# Altium schematic sheet FPGA Power.SchDoc
size A2; SheetNumber: 6; SheetTotal: 12
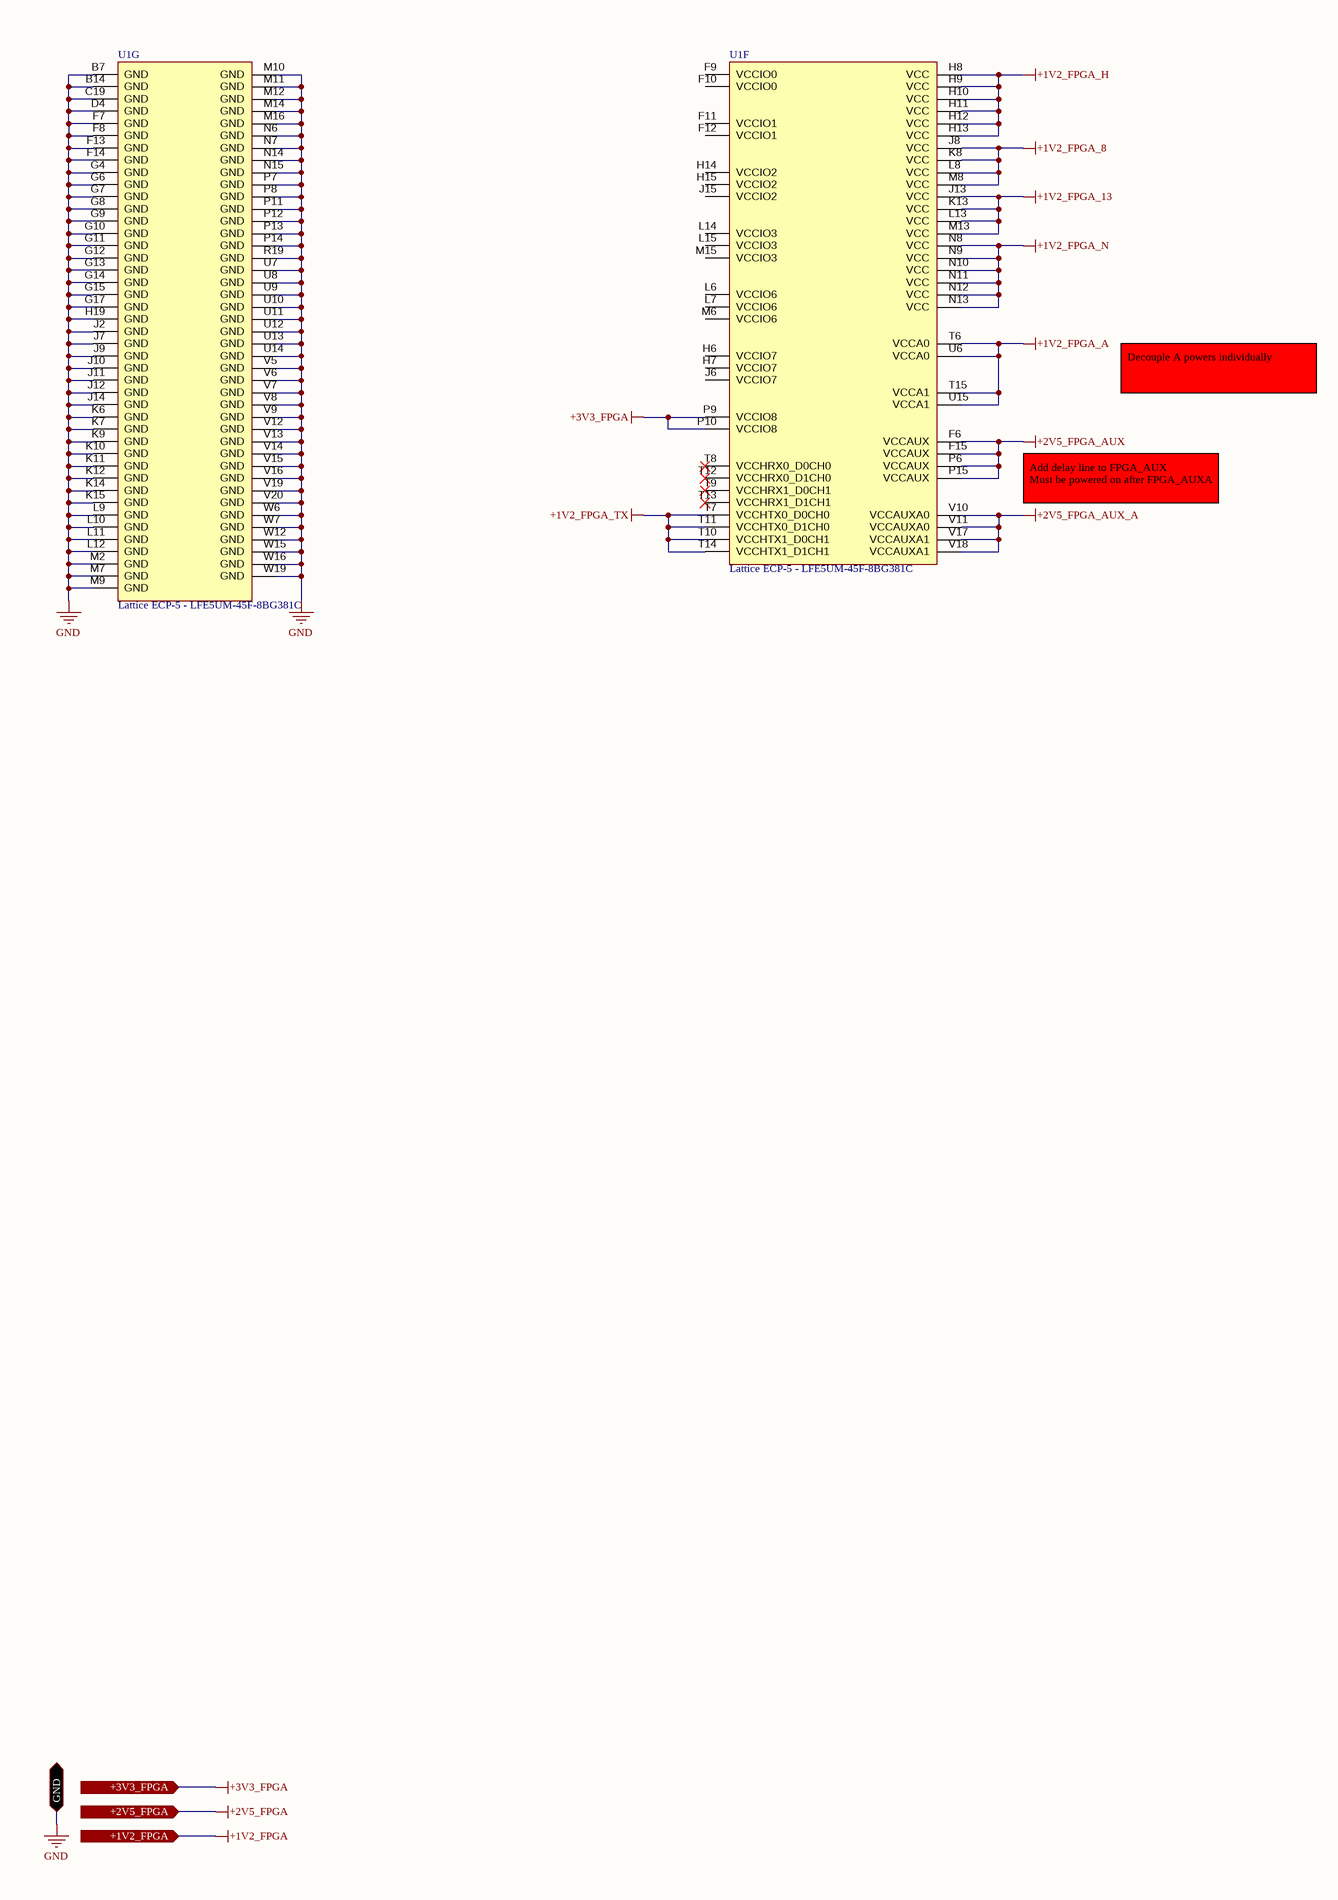
[diagram p0: FPGA Power.SchDoc, left]
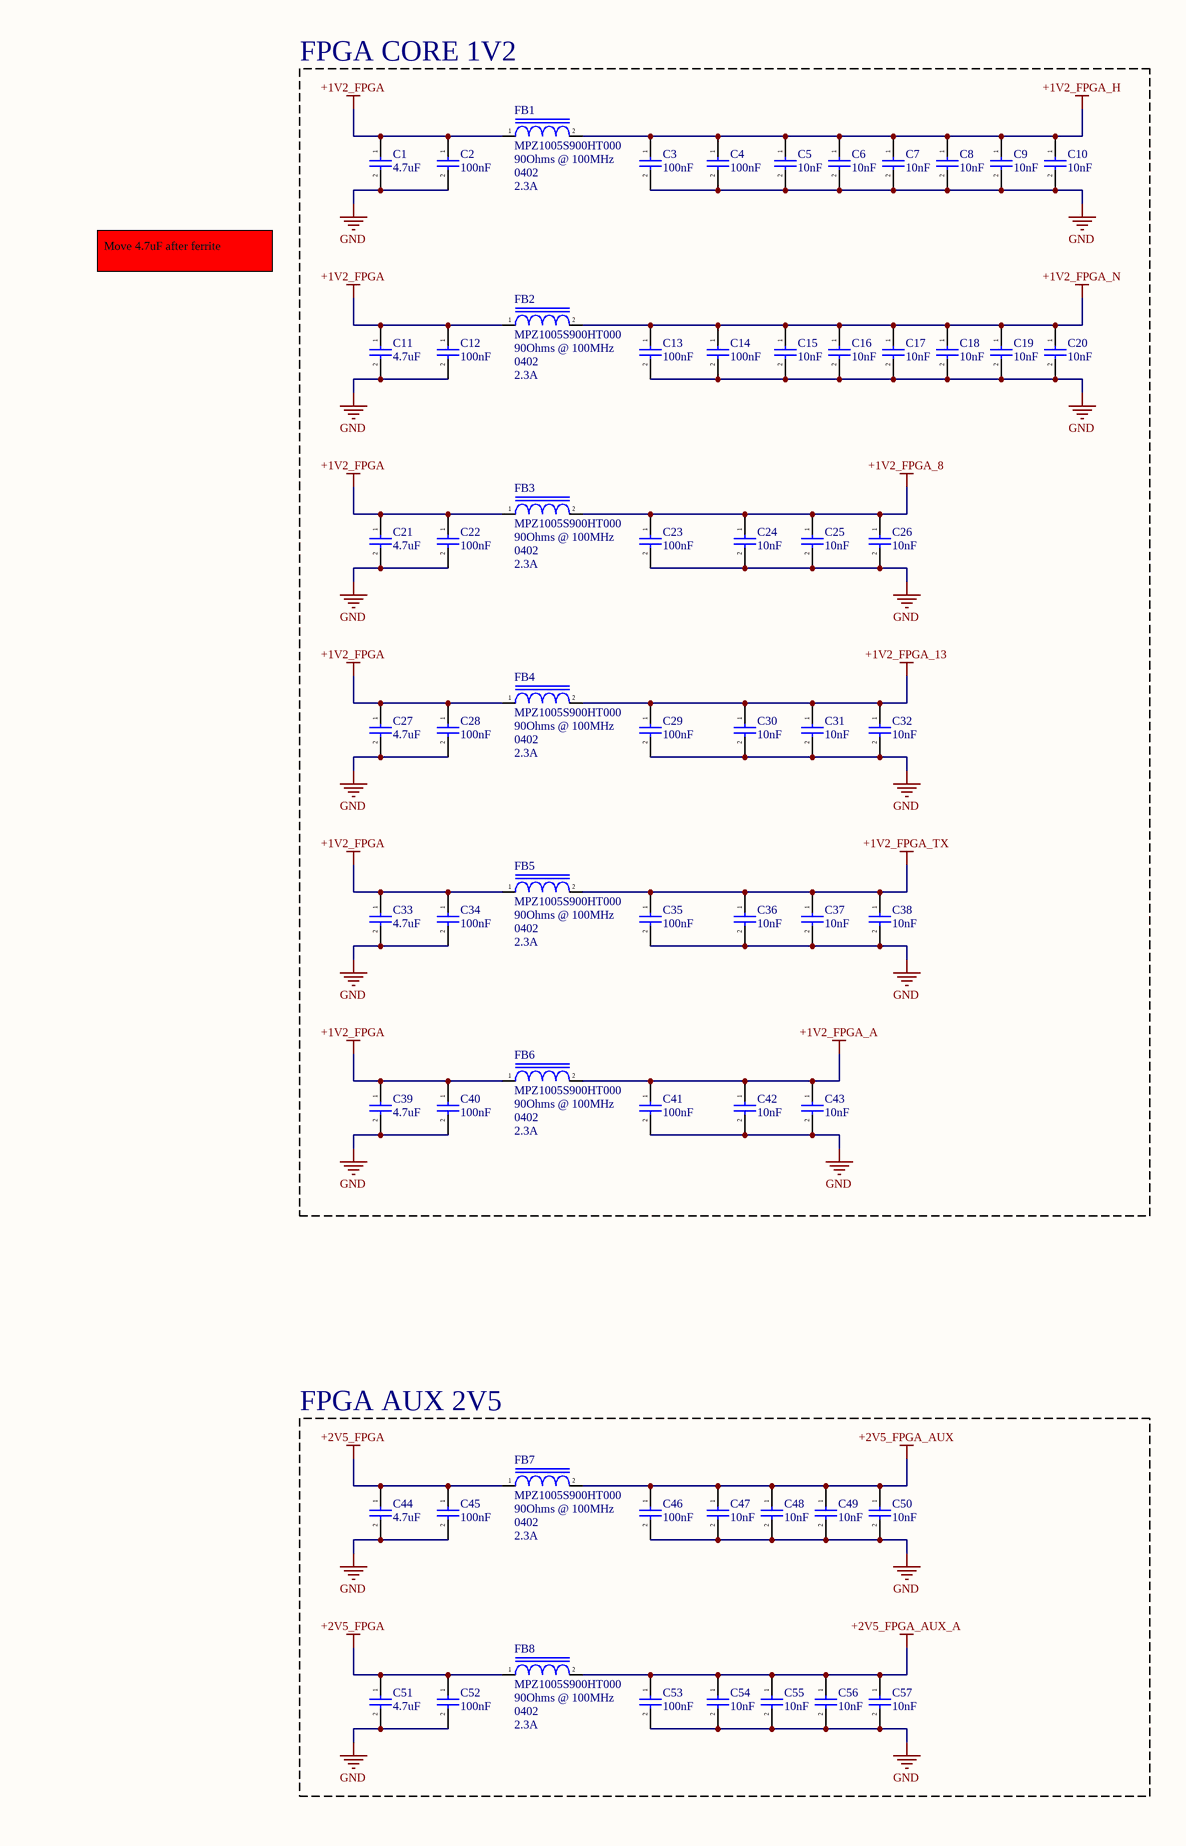
[diagram p1: FPGA Power.SchDoc, right]

## Parts
C1  4.7uF  [CAP_0805]
C2  100nF  [CAP_0402]
C3  100nF  [CAP_0402]
C4  100nF  [CAP_0402]
C5  10nF  [CAP_0201]
C6  10nF  [CAP_0201]
C7  10nF  [CAP_0201]
C8  10nF  [CAP_0201]
C9  10nF  [CAP_0201]
C10  10nF  [CAP_0201]
C11  4.7uF  [CAP_0805]
C12  100nF  [CAP_0402]
C13  100nF  [CAP_0402]
C14  100nF  [CAP_0402]
C15  10nF  [CAP_0201]
C16  10nF  [CAP_0201]
C17  10nF  [CAP_0201]
C18  10nF  [CAP_0201]
C19  10nF  [CAP_0201]
C20  10nF  [CAP_0201]
C21  4.7uF  [CAP_0805]
C22  100nF  [CAP_0402]
C23  100nF  [CAP_0402]
C24  10nF  [CAP_0201]
C25  10nF  [CAP_0201]
C26  10nF  [CAP_0201]
C27  4.7uF  [CAP_0805]
C28  100nF  [CAP_0402]
C29  100nF  [CAP_0402]
C30  10nF  [CAP_0201]
C31  10nF  [CAP_0201]
C32  10nF  [CAP_0201]
C33  4.7uF  [CAP_0805]
C34  100nF  [CAP_0402]
C35  100nF  [CAP_0402]
C36  10nF  [CAP_0201]
C37  10nF  [CAP_0201]
C38  10nF  [CAP_0201]
C39  4.7uF  [CAP_0805]
C40  100nF  [CAP_0402]
C41  100nF  [CAP_0402]
C42  10nF  [CAP_0201]
C43  10nF  [CAP_0201]
C44  4.7uF  [CAP_0805]
C45  100nF  [CAP_0402]
C46  100nF  [CAP_0402]
C47  10nF  [CAP_0201]
C48  10nF  [CAP_0201]
C49  10nF  [CAP_0201]
C50  10nF  [CAP_0201]
C51  4.7uF  [CAP_0805]
C52  100nF  [CAP_0402]
C53  100nF  [CAP_0402]
C54  10nF  [CAP_0201]
C55  10nF  [CAP_0201]
C56  10nF  [CAP_0201]
C57  10nF  [CAP_0201]
FB1  MPZ1005S900HT000  Impedance @ Freq: 90Ohms @ 100MHz  Package / Case: 0402  Current Rating: 2.3A  [IND_0402]
FB2  MPZ1005S900HT000  Impedance @ Freq: 90Ohms @ 100MHz  Package / Case: 0402  Current Rating: 2.3A  [IND_0402]
FB3  MPZ1005S900HT000  Impedance @ Freq: 90Ohms @ 100MHz  Package / Case: 0402  Current Rating: 2.3A  [IND_0402]
FB4  MPZ1005S900HT000  Impedance @ Freq: 90Ohms @ 100MHz  Package / Case: 0402  Current Rating: 2.3A  [IND_0402]
FB5  MPZ1005S900HT000  Impedance @ Freq: 90Ohms @ 100MHz  Package / Case: 0402  Current Rating: 2.3A  [IND_0402]
FB6  MPZ1005S900HT000  Impedance @ Freq: 90Ohms @ 100MHz  Package / Case: 0402  Current Rating: 2.3A  [IND_0402]
FB7  MPZ1005S900HT000  Impedance @ Freq: 90Ohms @ 100MHz  Package / Case: 0402  Current Rating: 2.3A  [IND_0402]
FB8  MPZ1005S900HT000  Impedance @ Freq: 90Ohms @ 100MHz  Package / Case: 0402  Current Rating: 2.3A  [IND_0402]
U1  Lattice ECP-5 - LFE5UM-45F-8BG381C  [CABGA-381]  (parts F,G of 7)

## Blocks framed on the sheet
FPGA CORE 1V2: C1-C43 FB1-FB6
FPGA AUX 2V5: C44-C57 FB7 FB8

## Ports
+1V2_FPGA (in), +2V5_FPGA (in), +3V3_FPGA (in), GND (bidir)

## Nets
+1V2_FPGA: C1.1 C2.1 C11.1 C12.1 C21.1 C22.1 C27.1 C28.1 C33.1 C34.1 C39.1 C40.1 FB1.1 FB2.1 FB3.1 FB4.1 FB5.1 FB6.1 ; port +1V2_FPGA
+1V2_FPGA_8: C23.1 C24.1 C25.1 C26.1 FB3.2 U1.J8(VCC) U1.K8(VCC) U1.L8(VCC) U1.M8(VCC)
+1V2_FPGA_13: C29.1 C30.1 C31.1 C32.1 FB4.2 U1.J13(VCC) U1.K13(VCC) U1.L13(VCC) U1.M13(VCC)
+1V2_FPGA_A: C41.1 C42.1 C43.1 FB6.2 U1.T6(VCCA0) U1.T15(VCCA1) U1.U6(VCCA0) U1.U15(VCCA1)
+1V2_FPGA_H: C3.1 C4.1 C5.1 C6.1 C7.1 C8.1 C9.1 C10.1 FB1.2 U1.H8(VCC) U1.H9(VCC) U1.H10(VCC) U1.H11(VCC) U1.H12(VCC) U1.H13(VCC)
+1V2_FPGA_N: C13.1 C14.1 C15.1 C16.1 C17.1 C18.1 C19.1 C20.1 FB2.2 U1.N8(VCC) U1.N9(VCC) U1.N10(VCC) U1.N11(VCC) U1.N12(VCC) U1.N13(VCC)
+1V2_FPGA_TX: C35.1 C36.1 C37.1 C38.1 FB5.2 U1.T7(VCCHTX0_D0CH0) U1.T10(VCCHTX1_D0CH1) U1.T11(VCCHTX0_D1CH0) U1.T14(VCCHTX1_D1CH1)
+2V5_FPGA: C44.1 C45.1 C51.1 C52.1 FB7.1 FB8.1 ; port +2V5_FPGA
+2V5_FPGA_AUX: C46.1 C47.1 C48.1 C49.1 C50.1 FB7.2 U1.F6(VCCAUX) U1.F15(VCCAUX) U1.P6(VCCAUX) U1.P15(VCCAUX)
+2V5_FPGA_AUX_A: C53.1 C54.1 C55.1 C56.1 C57.1 FB8.2 U1.V10(VCCAUXA0) U1.V11(VCCAUXA0) U1.V17(VCCAUXA1) U1.V18(VCCAUXA1)
+3V3_FPGA: U1.P9(VCCIO8) U1.P10(VCCIO8) ; port +3V3_FPGA
GND: C1.2 C2.2 C3.2 C4.2 C5.2 C6.2 C7.2 C8.2 C9.2 C10.2 C11.2 C12.2 C13.2 C14.2 C15.2 C16.2 C17.2 C18.2 C19.2 C20.2 C21.2 C22.2 C23.2 C24.2 C25.2 C26.2 C27.2 C28.2 C29.2 C30.2 C31.2 C32.2 C33.2 C34.2 C35.2 C36.2 C37.2 C38.2 C39.2 C40.2 C41.2 C42.2 C43.2 C44.2 C45.2 C46.2 C47.2 C48.2 C49.2 C50.2 C51.2 C52.2 C53.2 C54.2 C55.2 C56.2 C57.2 U1.B7(GND) U1.B14(GND) U1.C19(GND) U1.D4(GND) U1.F7(GND) U1.F8(GND) U1.F13(GND) U1.F14(GND) U1.G4(GND) U1.G6(GND) U1.G7(GND) U1.G8(GND) U1.G9(GND) U1.G10(GND) U1.G11(GND) U1.G12(GND) U1.G13(GND) U1.G14(GND) U1.G15(GND) U1.G17(GND) U1.H19(GND) U1.J2(GND) U1.J7(GND) U1.J9(GND) U1.J10(GND) U1.J11(GND) U1.J12(GND) U1.J14(GND) U1.K6(GND) U1.K7(GND) U1.K9(GND) U1.K10(GND) U1.K11(GND) U1.K12(GND) U1.K14(GND) U1.K15(GND) U1.L9(GND) U1.L10(GND) U1.L11(GND) U1.L12(GND) U1.M2(GND) U1.M7(GND) U1.M9(GND) U1.M10(GND) U1.M11(GND) U1.M12(GND) U1.M14(GND) U1.M16(GND) U1.N6(GND) U1.N7(GND) U1.N14(GND) U1.N15(GND) U1.P7(GND) U1.P8(GND) U1.P11(GND) U1.P12(GND) U1.P13(GND) U1.P14(GND) U1.R19(GND) U1.U7(GND) U1.U8(GND) U1.U9(GND) U1.U10(GND) U1.U11(GND) U1.U12(GND) U1.U13(GND) U1.U14(GND) U1.V5(GND) U1.V6(GND) U1.V7(GND) U1.V8(GND) U1.V9(GND) U1.V12(GND) U1.V13(GND) U1.V14(GND) U1.V15(GND) U1.V16(GND) U1.V19(GND) U1.V20(GND) U1.W6(GND) U1.W7(GND) U1.W12(GND) U1.W15(GND) U1.W16(GND) U1.W19(GND) ; port GND

Not connected (* = marked no-connect by the designer): U1 F9(VCCIO0) F10(VCCIO0) F11(VCCIO1) F12(VCCIO1) H6(VCCIO7) H7(VCCIO7) H14(VCCIO2) H15(VCCIO2) J6(VCCIO7) J15(VCCIO2) L6(VCCIO6) L7(VCCIO6) L14(VCCIO3) L15(VCCIO3) M6(VCCIO6) M15(VCCIO3) T8(VCCHRX0_D0CH0)* T9(VCCHRX1_D0CH1)* T12(VCCHRX0_D1CH0)* T13(VCCHRX1_D1CH1)*

## Notes on the sheet
- Move 4.7uF after ferrite
- Decouple A powers individually
- Add delay line to FPGA_AUX
  Must be powered on after FPGA_AUXA
- PROJECT
- TITLE
- FILE NAME
- A3
- SIZE
- DWG NO.
- SHEET
- OF
- REV

## Library data of the parts
C1-C57 = CAP_CER: Generic SMT Ceramic Capacitor; Voltage - Rated: 25V; Operating Temperature: *; Tolerance: *; Mfr: *; ComponentLink1Description: Digikey; ComponentLink1URL: [Digikey Link]; Digikey Part No: *; ComponentLink2Description: Datasheet; ComponentLink2URL: [Datasheet Link]
  C1 C11 C21 C27 C33 C39 C44 C51: Footprint: 0805
  C2-C4 C12-C14 C22 C23 C28 C29 C34 C35 C40 C41 C45 C46 C52 C53: Footprint: 0402
  C5-C10 C15-C20 C24-C26 C30-C32 C36-C38 C42 C43 C47-C50 C54-C57: Footprint: 0201
FB1-FB8 = IND_MPZ1005S900HT000: 90 Ohms @ 100 MHz 1 Power Line Ferrite Bead 0402 (1005 Metric) 2.3A 38mOhm; Resistance: 38mOhms; Operating Temperature: -55C - 125C; Rating: AEC-Q200
U1 = IC_LFE5UM-45F-8BG381C: IC FPGA 203 I/O 381CABGA; Mfr: Lattice Semiconductors; Supply Voltage: 1.045V - 1.115V; LABs/CLBs: 11000; Logic Elements: 44000; IOs: 203; RAM Bits: 1990656; Operating Temperature: 0C - 85C; Package / Case: 381-CABGA